# Altium schematic sheet Pg4-Power supply 1.SchDoc: Isolated Poser Supply 1
size 431 x 279 mm; Date: Not shown in title block; ApprovedBy: Not shown in title block; CheckedBy: Not shown in title block; Author: Not shown in title block; CompanyName: Not shown in title block; Engineer: Not shown in title block; Organization: Not shown in title block; Address1: Not shown in title block; Address2: Not shown in title block; Address3: Not shown in title block; Address4: Not shown in title block; DocumentNumber: 5; Revision: Use project parameter SCH_Rev; SheetNumber: 4; SheetTotal: 7; PageSetup: Record=PageOptions|CenterHorizontal=True|CenterVertical=True|PrintScale=0.62|XCorrection=1.00|YCorrection=1.00|PrintKind=0|BorderSize=5000000|LeftOffset=0|BottomOffset=0|Orientation=2|PaperLength=1000|PaperWidth=1000|Scale=100|PaperSource=15|PrintQuality=600|MediaType=1|DitherType=10|PaperKind=Letter|PrintScaleMode=1; CurrentTime: Not shown in title block; CurrentDate: Not shown in title block; Time: Not shown in title block; DocumentFullPathAndName: Not shown in title block; DocumentName: Not shown in title block; ModifiedDate: Not shown in title block; ImagePath: Not shown in title block
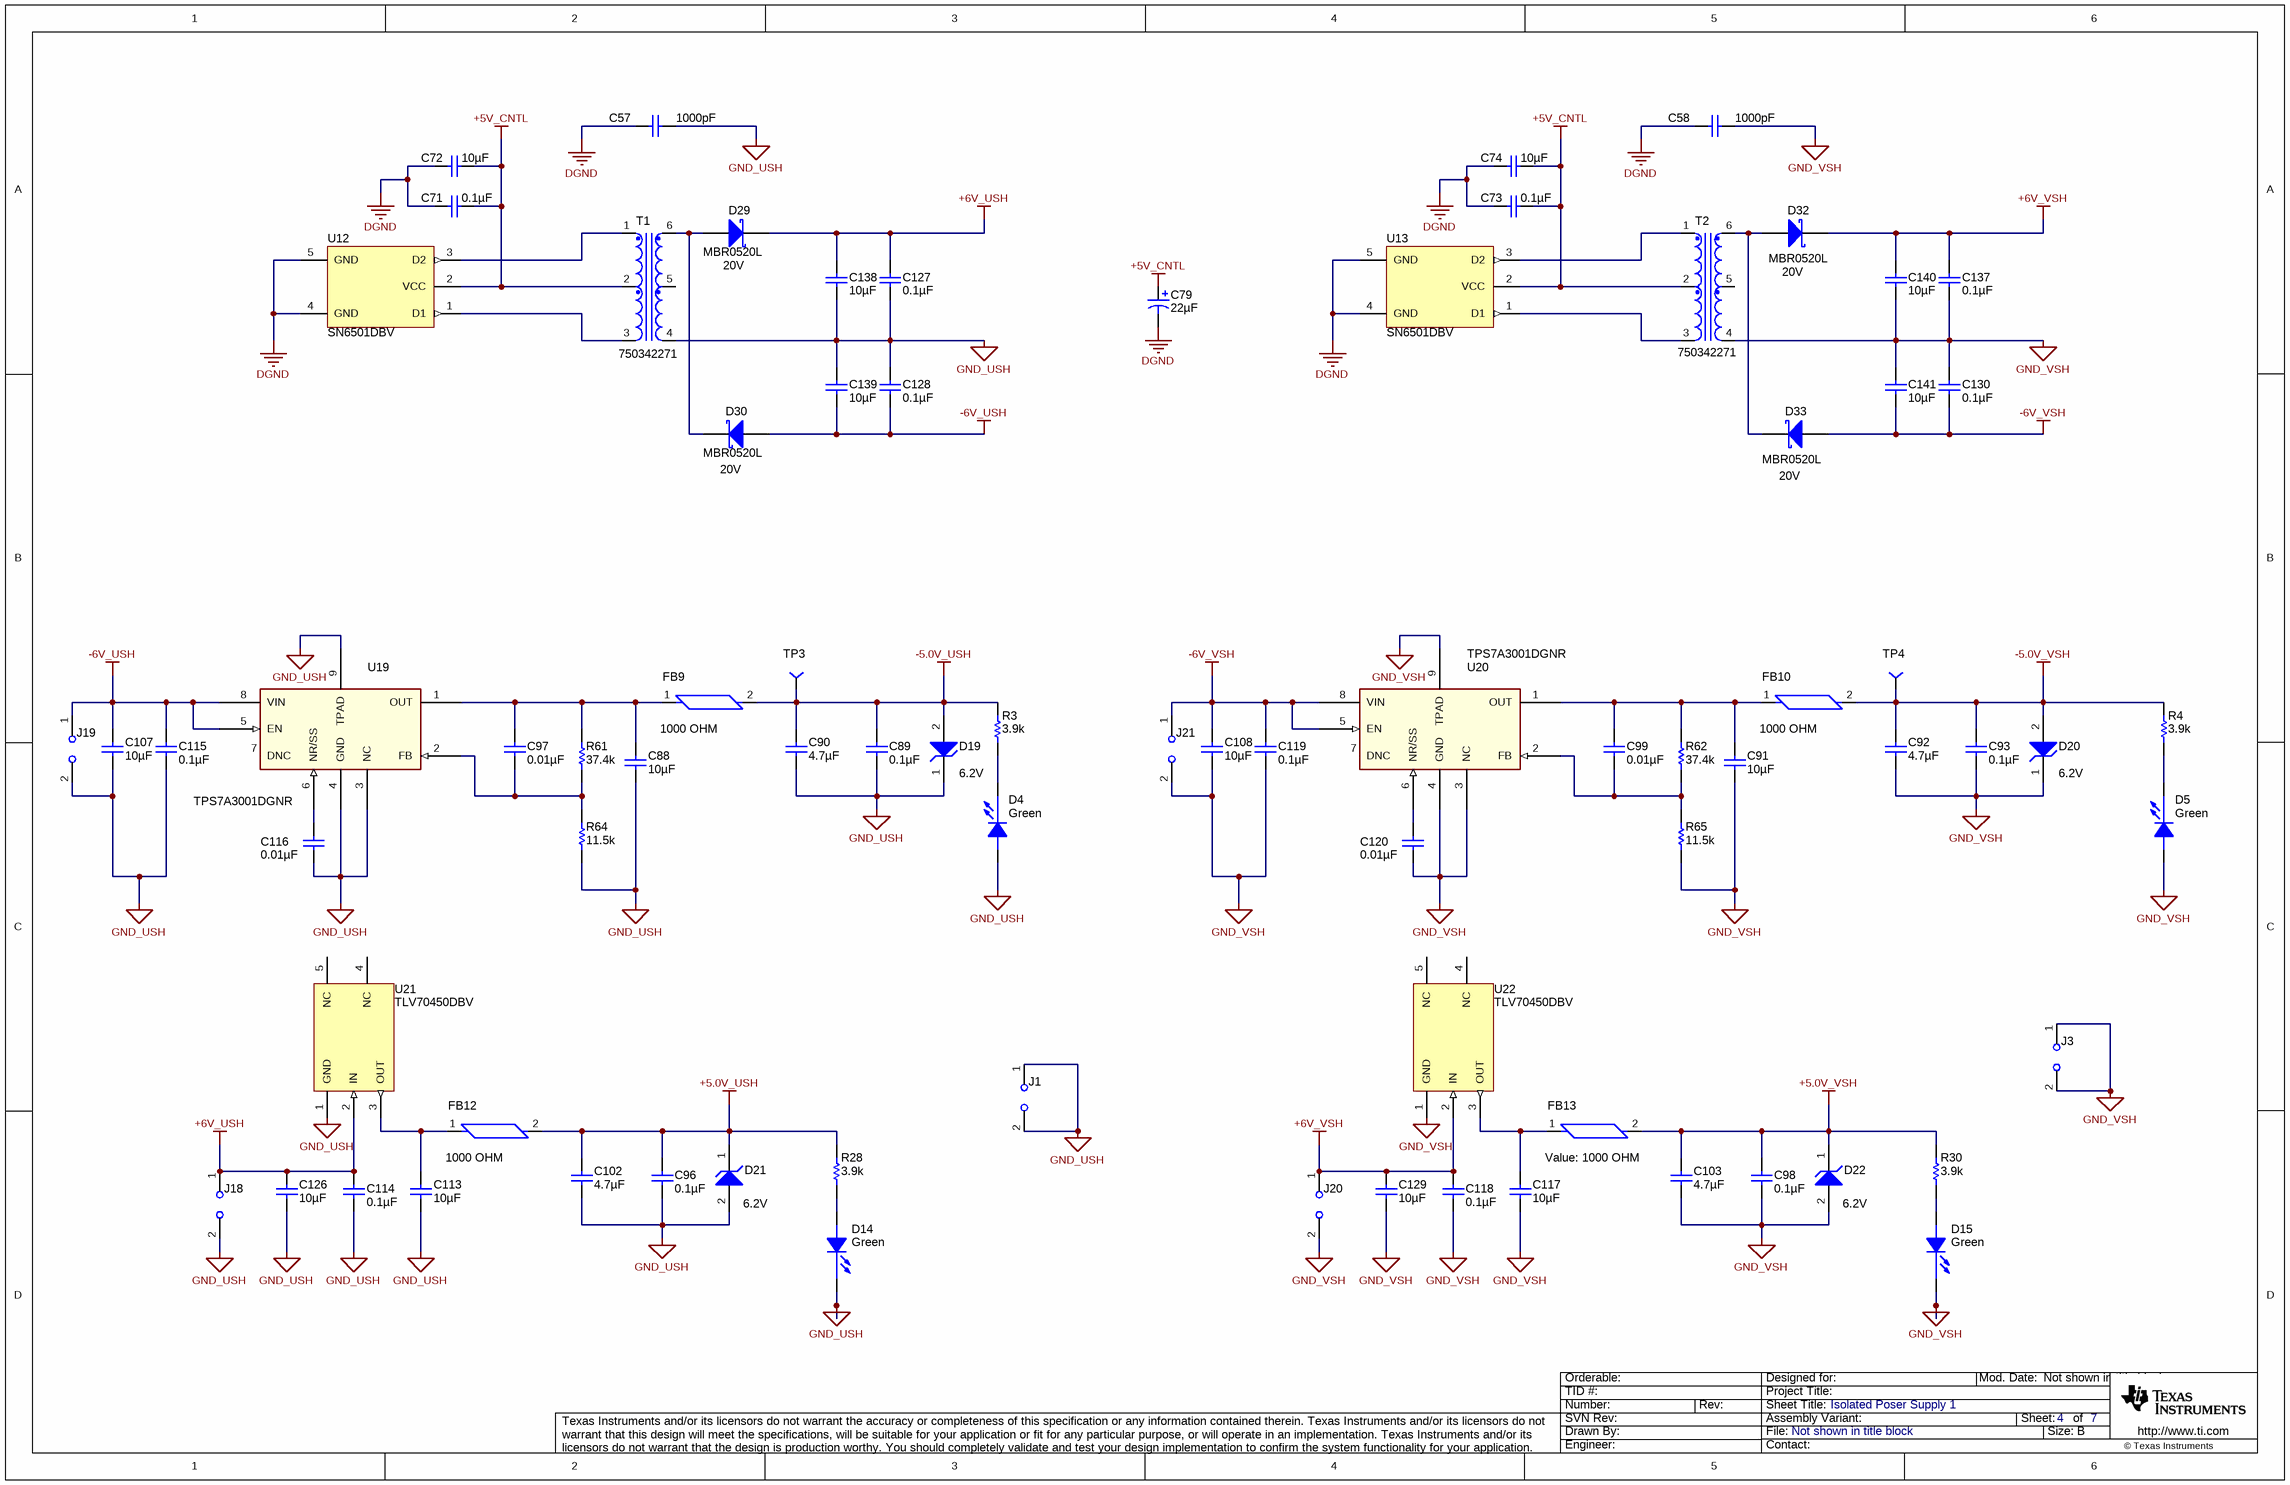
[diagram p0: Pg4-Power supply 1.SchDoc]

## Parts
C57  value 1000pF  [CAP_200mil]
C58  value 1000pF  [CAP_200mil]
C71  ValueDisplayed: 0.1µF  [0603]
C72  ValueDisplayed: 10µF  [1210]
C73  ValueDisplayed: 0.1µF  [0603]
C74  ValueDisplayed: 10µF  [1210]
C79  ValueDisplayed: 22µF  [SM_RADIAL_5MM]  (hidden comment: UUD1E220MCL1GS)
C88  ValueDisplayed: 10µF  [1210]
C89  ValueDisplayed: 0.1µF  [0603]
C90  ValueDisplayed: 4.7µF  [0805_HV]
C91  ValueDisplayed: 10µF  [1210]
C92  ValueDisplayed: 4.7µF  [0805_HV]
C93  ValueDisplayed: 0.1µF  [0603]
C96  ValueDisplayed: 0.1µF  [0603]
C97  ValueDisplayed: 0.01µF  [0603]
C98  ValueDisplayed: 0.1µF  [0603]
C99  ValueDisplayed: 0.01µF  [0603]
C102  ValueDisplayed: 4.7µF  [0805_HV]
C103  ValueDisplayed: 4.7µF  [0805_HV]
C107  ValueDisplayed: 10µF  [1210]
C108  ValueDisplayed: 10µF  [1210]
C113  ValueDisplayed: 10µF  [1210]
C114  ValueDisplayed: 0.1µF  [0603]
C115  ValueDisplayed: 0.1µF  [0603]
C116  ValueDisplayed: 0.01µF  [0603]
C117  ValueDisplayed: 10µF  [1210]
C118  ValueDisplayed: 0.1µF  [0603]
C119  ValueDisplayed: 0.1µF  [0603]
C120  ValueDisplayed: 0.01µF  [0603]
C126  ValueDisplayed: 10µF  [1210]
C127  ValueDisplayed: 0.1µF  [0603]
C128  ValueDisplayed: 0.1µF  [0603]
C129  ValueDisplayed: 10µF  [1210]
C130  ValueDisplayed: 0.1µF  [0603]
C137  ValueDisplayed: 0.1µF  [0603]
C138  ValueDisplayed: 10µF  [1210]
C139  ValueDisplayed: 10µF  [1210]
C140  ValueDisplayed: 10µF  [1210]
C141  ValueDisplayed: 10µF  [1210]
D4  value Green  [LED0603AA]
D5  value Green  [LED0603AA]
D14  value Green  [LED0603AA]
D15  value Green  [LED0603AA]
D19  value 6.2V  [powerDI123]
D20  value 6.2V  [powerDI123]
D21  value 6.2V  [powerDI123]
D22  value 6.2V  [powerDI123]
D29  MBR0520L  value 20V  [SOD-123]
D30  MBR0520L  value 20V  [SOD-123]
D32  MBR0520L  value 20V  [SOD-123]
D33  MBR0520L  value 20V  [SOD-123]
FB9  value 1000 OHM  [FB0603]
FB10  value 1000 OHM  [FB0603]
FB12  value 1000 OHM  [FB0603]
FB13  value 1000 OHM  [FB0603]
J1  (no value)  [HDR100_1X2]
J3  (no value)  [HDR100_1X2]
J18  (no value)  [HDR100_1X2]
J19  (no value)  [HDR100_1X2]
J20  (no value)  [HDR100_1X2]
J21  (no value)  [HDR100_1X2]
R3  value 3.9k  [0603]
R4  value 3.9k  [0603]
R28  value 3.9k  [0603]
R30  value 3.9k  [0603]
R61  value 37.4k  [0603]
R62  value 37.4k  [0603]
R64  value 11.5k  [0603]
R65  value 11.5k  [0603]
T1  750342271  [760390015]
T2  750342271  [760390015]
TP3  (no value)  [TP-040_RND]
TP4  (no value)  [TP-040_RND]
U12  SN6501DBV  [DBV0005A_N]
U13  SN6501DBV  [DBV0005A_N]
U19  TPS7A3001DGNR  [MSOP8(DGN)]
U20  (no value)  [MSOP8(DGN)]
U21  TLV70450DBV  [DBV0005A_N]
U22  TLV70450DBV  [DBV0005A_N]

## Nets
+5.0V_USH: C96.1 C102.2 D21.1(K) FB12.2 R28.2
+5.0V_VSH: C98.1 C103.2 D22.1(K) FB13.2 R30.2
+5V_CNTL: C71.2 C72.2 C73.2 C74.2 C79.1(+) T1.2 T2.2 U12.2(VCC) U13.2(VCC)
+6V_USH: C114.1 C126.2 C127.1 C138.1 D29.1(K) J18.1 U21.2(IN)
+6V_VSH: C118.1 C129.2 C137.1 C140.1 D32.1(K) J20.1 U22.2(IN)
-5.0V_USH: C89.1 C90.2 D19.2(A) FB9.2 R3.2 TP3.1
-5.0V_VSH: C92.2 C93.1 D20.2(A) FB10.2 R4.2 TP4.1
-6V_USH: C107.2 C115.1 C128.2 C139.2 D30.2(A) J19.1 U19.5(EN) U19.8(VIN)
-6V_VSH: C108.2 C119.1 C130.2 C141.2 D33.2(A) J21.1 U20.5(EN) U20.8(VIN)
DGND: C57.1 C58.1 C71.1 C72.1 C73.1 C74.1 C79.2(-) U12.4(GND) U12.5(GND) U13.4(GND) U13.5(GND)
GND_USH: C57.2 C88.1 C89.2 C90.1 C96.2 C102.1 C107.1 C113.1 C114.2 C115.2 C116.1 C126.1 C127.2 C128.1 C138.2 C139.1 D4.2(A) D14.1(C) D19.1(K) D21.2(A) J1.1 J1.2 J18.2 J19.2 R64.1 T1.4 U19.3(NC) U19.4(GND) U19.9(TPAD) U21.1(GND)
GND_VSH: C58.2 C91.1 C92.1 C93.2 C98.2 C103.1 C108.1 C117.1 C118.2 C119.2 C120.1 C129.1 C130.1 C137.2 C140.2 C141.1 D5.2(A) D15.1(C) D20.1(K) D22.2(A) J3.1 J3.2 J20.2 J21.2 R65.1 T2.4 U20.3(NC) U20.4(GND) U20.9(TPAD) U22.1(GND)
NetC88_2: C88.2 C97.2 FB9.1 R61.2 U19.1(OUT)
NetC91_2: C91.2 C99.2 FB10.1 R62.2 U20.1(OUT)
NetC97_1: C97.1 R61.1 R64.2 U19.2(FB)
NetC99_1: C99.1 R62.1 R65.2 U20.2(FB)
NetC113_2: C113.2 FB12.1 U21.3(OUT)
NetC116_2: C116.2 U19.6(NR/SS)
NetC117_2: C117.2 FB13.1 U22.3(OUT)
NetC120_2: C120.2 U20.6(NR/SS)
NetD4_1: D4.1(C) R3.1
NetD5_1: D5.1(C) R4.1
NetD14_2: D14.2(A) R28.1
NetD15_2: D15.2(A) R30.1
NetD29_2: D29.2(A) D30.1(K) T1.6
NetD32_2: D32.2(A) D33.1(K) T2.6
NetT1_1: T1.1 U12.3(D2)
NetT1_3: T1.3 U12.1(D1)
NetT2_1: T2.1 U13.3(D2)
NetT2_3: T2.3 U13.1(D1)

Not connected (* = marked no-connect by the designer): T1 5; T2 5; U19 7(DNC); U20 7(DNC); U21 4(NC) 5(NC); U22 4(NC) 5(NC)

## Notes on the sheet
- Drawn By:
- SVN Rev:
- Number:
- TID #:
- Orderable:
- Rev:
- Sheet Title:
- File:
- Project Title:
- Designed for:
- Assembly Variant:
- Mod. Date:
- Sheet:
- Size:
- of
- B
- http://www.ti.com
- Texas Instruments and/or its licensors do not warrant the accuracy or completeness of this specification or any information contained therein. Texas Instruments and/or its licensors do not warrant that this design will meet the specifications, will be suitable for your application or fit for any particular purpose, or will operate in an implementation. Texas Instruments and/or its licensors do not warrant that the design is production worthy. You should completely validate and test your design implementation to confirm the system functionality for your application.
- Engineer:
- Contact:
- © Texas Instruments

## Library data of the parts
C57 C58 = 202R18W102KV4E: CAP CER 1000PF 1KV 10% RADIAL; PartNumber: S102K29Y5PN63J5R; Manufacturer: Vishay BC Components; Polarized: N; CompType: Capacitor; Tolerance_%: 0; ValueDisplayed: 1000pF; RoHS: Y; Value2: 1kv; MountType: radial; Technology: Ceramic; Publisher: Texas Instruments; ComponentLink1Description: Datasheet link; ComponentLink1URL: http://www.johansondielectrics.com/images/stories/catalog/JDI-Product-Catalog.pdf; Supplier 1: Digi-Key; Supplier Part Number 1: 1251PH-ND
C71 C73 C89 C93 C96 C98 C114 C115 C118 C119 C127 C128 C130 C137 = C0603C104K5RACTU: CAP, CERM, 0.1uF, 50V, +/-10%, X7R, 0603; Manufacturer: Kemet; Polarized: N; CompType: Capacitor; U/M: EA; Cap_F: 0.0000001; Tolerance_%: 10; Value1: Unknown; VDC_V: 50; TaMin_C: -55; TaMax_C: 125; SymbolVersion: 2008-07-09; Value: 0.1uF; PartNumber: C0603C104K5RACTU; PackageReference: 0603; RoHS: Y; Value2: 50V; MountType: SMT; Technology: Ceramic; TempCo: X7R; Cap_Case: 0603; Published: 2008-06-19; Publisher: Texas Instruments; LatestRevisionDate: 2013-12-06; ComponentLink1Description: Datasheet link; ComponentLink1URL: http://www.kemet.com/kemet/web/homepage/kechome.nsf/vapubfiles/F3102_Y5V.pdf/$file/F3102_Y5V.pdf; Supplier 1: Digi-Key; Supplier Part Number 1: 399-5089-1-ND; Supplier 2: Mouser; Supplier Part Number 2: 80-C0603C104K5R; Supplier 3: Farnell; Supplier Part Number 3: 1288255
C72 C74 C88 C91 C107 C108 C113 C117 C126 C129 C138-C141 = GMK325AB7106MM-T: CAP, CERM, 10uF, 35V, +/-20%, X7R, 1210; Manufacturer: Taiyo Yuden; Polarized: N; CompType: Capacitor; U/M: EA; Cap_F: 0.00001; Tolerance_%: 20; Value1: Unknown; VDC_V: 35; TaMin_C: -55; TaMax_C: 125; PackageReference: 1210; PartNumber: GMK325AB7106MM-T; SymbolVersion: 2008-07-09; Value: 10uF; RoHS: Y; Value2: 35V; MountType: SMT; Technology: Ceramic; Cap_Case: 1210; Publisher: Texas Instruments; LatestRevisionDate: 2013-12-06; ComponentLink1Description: Datasheet link; ComponentLink1URL: http://www.yuden.co.jp/productdata/catalog/en/mlcc01_e.pdf; Supplier 1: Digi-Key; Supplier Part Number 1: 587-2779-1-ND; Supplier 2: Mouser; Supplier Part Number 2: 963-GMK325AB7106MM-T; Supplier 3: Farnell; Supplier Part Number 3: 1894510; TempCo: X7R; Published: 2008-06-19
C79 = UUD1E220MCL1GS: CAP, AL, 22uF, 25V, +/-20%, 0.76 ohm, SMD; Manufacturer: Nichicon; Polarized: Y; CompType: Capacitor; U/M: EA; Cap_F: 0.000022; Tolerance_%: 20; VDC_V: 25; ESR_Ohm: 0.76; IRMS_A: 0.15; TaMin_C: -55; TaMax_C: 105; Cap_Case: 5x5.8; SymbolVersion: 2008-07-09; Value: 22uF; PartNumber: UUD1E220MCL1GS; PackageReference: 5x5.8; RoHS: Y; Value1: 0.76 ohm; Value2: 25V; MountType: SMT; Technology: AL; Series: uD; Publisher: Texas Instruments; LatestRevisionDate: 2014-01-08; ComponentLink1Description: Datasheet link; ComponentLink1URL: http://products.nichicon.co.jp/en/pdf/XJA043/e-ud.pdf; Supplier 1: Digi-Key; Supplier Part Number 1: 493-2270-1-ND; Supplier 2: Mouser; Supplier Part Number 2: 647-UUD1E220MCL; Supplier 3: Farnell; Supplier Part Number 3: 1899607
C90 C92 C102 C103 = C2012X5R1H475K125AB: CAP, CERM, 4.7uF, 50V, +/-10%, X5R, 0805; Manufacturer: TDK; Polarized: N; CompType: Capacitor; U/M: EA; Cap_F: 0.0000047; Tolerance_%: 10; Value1: Unknown; VDC_V: 50; TaMin_C: -55; TaMax_C: 85; Cap_Case: 0805; PackageReference: 0805; PartNumber: C2012X5R1H475K125AB; SymbolVersion: 2008-07-09; Value: 4.7uF; RoHS: Y; Value2: 50V; MountType: SMT; Technology: Ceramic; Publisher: Texas Instruments; LatestRevisionDate: 2013-12-06; ComponentLink1Description: Datasheet link; ComponentLink1URL: http://product.tdk.com/capacitor/mlcc/en/productguide/pdf/mlcc_selection_guide_en_03.pdf; Supplier 1: Digi-Key; Supplier Part Number 1: 445-5980-1-ND; TempCo: X5R; Published: 2008-06-19
C97 C99 C116 C120 = 06031C103JAT2A: CAP, CERM, 0.01uF, 100V, +/-5%, X7R, 0603; PartNumber: 06031C103J4Z4A; Manufacturer: AVX; Polarized: N; CompType: Capacitor; U/M: EA; Cap_F: 0.00000001; Tolerance_%: 5; ESR_Ohm: 0.098; Value1: 0.098 ohm; VDC_V: 100; TaMin_C: -55; TaMax_C: 125; SymbolVersion: 2008-07-09; Value: 0.01uF; PackageReference: 0603; RoHS: Y; Value2: 100V; MountType: SMT; Technology: Ceramic; TempCo: X7R; Cap_Case: 0603; Published: 2008-06-19; Publisher: Texas Instruments; LatestRevisionDate: 2013-11-21; ComponentLink1Description: Datasheet link; ComponentLink1URL: http://www.avx.com/docs/masterpubs/smccp.pdf; Supplier 1: Digi-Key; Supplier Part Number 1: 478-7418-1-ND; Supplier 2: Mouser; Supplier Part Number 2: 581-06031C103J; Supplier 3: Farnell; Supplier Part Number 3: 1833876
D4 D5 D14 D15 = LED_LG L29K-G2J1-24-Z: LED SmartLED Green 570NM; Manufacturer: OSRAM; SymbolCreator: x0120606; CompType: *; PartNumber: LG L29K-G2J1-24-Z; Alternate Manufacturer: LED; PackageReference: 0603; ComponentLink1URL: http://catalog.osram-os.com/catalogue/catalogue.do;jsessionid=32CB61882C089EDD4B6D0A54E7E1F117?act=downloadFile&favOid=020000020000138e000100b6; Alternate PartNumber: *; ComponentLink1Description: Datasheet link; Supplier Part Number 1: 475-2709-2-ND; Supplier 1: Digi-Key; MountType: SMT; Publisher: TI
D19-D22 = DFLZ6V2-7: Diode, Zener, 6.2V, 1W, PowerDI123; Manufacturer: Diodes Inc.; U/M: EA; Power_W: 1; Vz_V: 6.2; RJA_CperW: 110; CompType: Zener; SymbolVersion: 2010-08-25; PartNumber: DFLZ6V2-7; PackageReference: PowerDI123; Vr_V: N/A; Value1: 1W; MountType: SMT; RoHS: Y; ComponentLink1Description: Datasheet link; ComponentLink1URL: http://www.diodes.com/datasheets/ds30464.pdf; Published: 2008-10-08; Publisher: Texas Instruments; LatestRevisionDate: 2013-11-26; LatestRevisionNote: Updated Supplier Data; Supplier 1: Digi-Key; Supplier Part Number 1: DFLZ6V2DICT-ND; Supplier 2: Mouser; Supplier Part Number 2: 621-DFLZ6V2-7; Supplier 3: Farnell; Supplier Part Number 3: 2077983
D29 D30 D32 D33 = MBR0520LT1G: Diode, Schottky, 20V, 0.5A, SOD-123; Manufacturer: Fairchild Semiconductor; U/M: EA; Vf_V: 0.385; Value2: 0.385V; Io_A: 0.5; Vr_V: 20; TJmax_C: 125; RJC_CperW: 150; CompType: Diode; SymbolVersion: 2008-12-08; PartNumber: MBR0520L; PackageReference: SOD-123; Value1: 0.5A; MountType: SMT; Type: Schottky; RoHS: Y; Published: 2008-06-26; Publisher: Texas Instruments; LatestRevisionDate: 2013-12-18; ComponentLink1Description: Datasheet link; ComponentLink1URL: http://www.onsemi.com/pub_link/Collateral/MBR0520LT1-D.PDF; Supplier 1: Digi-Key; Supplier Part Number 1: MBR0520LCT-ND; Supplier 2: Mouser; Supplier Part Number 2: 863-MBR0520LT1G; Supplier 3: Farnell; Supplier Part Number 3: 9556915
FB9 FB10 FB12 FB13 = MMZ1608B102C: FERRITE CHIP 1000 OHM 300MA 0603; Manufacturer: TDK Corporation; CompType: Ferrite Bead; PartNumber: MMZ1608B102C; MountType: SMT; Alternate PartNumber: *; Supplier 1: Digi-Key; ComponentLink1URL: http://www.tdk.co.jp/tefe02/e9412_mmz.pdf; ComponentLink1Description: Datasheet link; Publisher: TI; Supplier Part Number 1: 445-8672-1-ND; PackageReference: 0603; Alternate Manufacturer: *; RoHS: Y
J1 J3 J18-J21 = JUMPER_2X100MIL: Header, Male 2-pin, 100mil spacing,; Manufacturer: FCI; PartNumber: 68001-402HLF; area: 20000; Value: 68001-402HLF; ComponentLink1URL: \\vette02\pmp_pcb\pcad_pdf's\pec36saan.pdf; ComponentHeight: 0.330 inch; SymbolVersion: 09/30/2009 09:55:05; PackageReference: 0.100 inch x 2; ComponentLink1Description: AEO Datasheet Link; Supplier 1: Digi-Key; Supplier Part Number 1: 609-3507-ND
R3 R4 R28 R30 = CRCW06033K90JNEA: RES, 3.9k ohm, 5%, 0.1W, 0603; Manufacturer: Vishay-Dale; CompType: Resistor; Res_ohm: 3900; Value_Code: 3k90; Tolerance_%: 5; Power_W: 0.1; VDC_V: 75; TempCo: 200 ppm/C; EIA_Code: E24; U/M: EA; SymbolVersion: 2009-05-29; PartNumber: CRCW06033K90JNEA; PackageReference: 0603; RoHS: Y; Value1: 5%; Value2: 0.1W; MountType: SMT; Technology: Thick Film; Published: 2008-06-26; Publisher: Texas Instruments; LatestRevisionDate: 2013-10-22; ComponentLink1Description: Datasheet link; ComponentLink1URL: http://www.vishay.com/docs/20035/dcrcwe3.pdf; Supplier 1: Digi-Key; Supplier Part Number 1: 541-3.9KGCT-ND; Supplier 2: Farnell; Supplier Part Number 2: 1563917; Supplier 3: Newark; Supplier Part Number 3: 72M6834
R61 R62 = RT0603BRD0737KL: RES 37.4K OHM 1/10W .1% 0603 SMD; PartNumber: ERA-3AEB3742V; Manufacturer: Panasonic; CompType: Resistor; Res_ohm: 37000; Value_Code: 37k4; Tolerance_%: 1%; Power_W: 0.1; Value2: 0.1W; VDC_V: 75; TempCo: 25 ppm/C; EIA_Code: E192; U/M: EA; SymbolVersion: 2009-05-29; PackageReference: 0603; RoHS: Y; MountType: SMT; Technology: Thin Film; Published: 2008-06-26; Publisher: Texas Instruments; LatestRevisionDate: 2013-10-22; ComponentLink1Description: Datasheet link; ComponentLink1URL: http://www.yageo.com/pdf/PYu-RT_1-to-0.05_RoHS_L_3.pdf; Supplier 1: Digi-Key; Supplier Part Number 1: P37.4KDBCT-ND
R64 R65 = CRCW060311K5FKEA: RES, 11.5k ohm, 1%, 0.1W, 0603; Manufacturer: Vishay-Dale; CompType: Resistor; Res_ohm: 11500; Value_Code: 11k5; Tolerance_%: 1; Power_W: 0.1; VDC_V: 75; TempCo: 100 ppm/C; EIA_Code: E96; U/M: EA; SymbolVersion: 2009-05-29; PartNumber: CRCW060311K5FKEA; PackageReference: 0603; RoHS: Y; Value1: 1%; Value2: 0.1W; MountType: SMT; Technology: Thick Film; Published: 2008-06-26; Publisher: Texas Instruments; LatestRevisionDate: 2013-10-22; ComponentLink1Description: Datasheet link; ComponentLink1URL: http://www.vishay.com/docs/20035/dcrcwe3.pdf; Supplier 1: Digi-Key; Supplier Part Number 1: 541-11.5KHCT-ND; Supplier 2: Mouser; Supplier Part Number 2: 71-CRCW0603-11.5K-E3; Supplier 3: Farnell; Supplier Part Number 3: 1469753
T1 T2 = TRNSFMR: Transformer 469uH SMD; Manufacturer: Wurth Electronics Midcom; Alternate Manufacturer: *; RoHS: Y; Value: 469uH; MountType: SMT; PartNumber: 750342271; PackageReference: 10.05mm L x 6.73mm W; Publisher: TI; ComponentLink1Description: Datasheet Link; Alternate PartNumber: *; CompType: Transformer; Supplier 1: Digi-Key
TP3 TP4 = TP-040_RND: Test Point, O.040 Hole; Manufacturer: STD; Value: STD; area: *; SymbolVersion: 06/30/2008 16:03:57; PartNumber: STD; ComponentLink1Description: AEO Datasheet Link
U12 U13 = SN6501DBV: Transformer Driver for Isolated Power Supplies, DBV0005A; Alternate Manufacturer: None; Manufacturer: Texas Instruments; SymbolCreator: a0411947; CompType: IC; U/M: EA; SymbolVersion: 2013-06-28; PartNumber: SN6501DBV; PackageReference: DBV0005A; MountType: SMT; ComponentLink1Description: Datasheet Link; ComponentLink1URL: http://www.ti.com/lit/ds/symlink/sn6501.pdf; RoHS: Y; Publisher: Texas Instruments; LatestRevisionDate: 2013-12-23
U19 U20 = TPS7A3001DGNR: -36V, -200mA, Ultralow-Noise, Negative Linear Regulator; Alternate Manufacturer: None; Manufacturer: Texas Instruments; CompType: IC; SymbolCreator: x0120606; ComponentLink1URL: http://www.ti.com/lit/ds/symlink/tps7a3001.pdf; ComponentLink1Description: Datasheet Link; Publisher: Texas Instruments; PackageReference: MSOP-PowerPAD (DGN) | 8; RoHS: Y; PartNumber: TPS7A3001DGNR; MountType: SMT
U21 U22 = TLV70450DBV: Regulator, LDO, 5V, 0.15A, SOT23-5; Alternate Manufacturer: None; Manufacturer: Texas Instruments; SymbolCreator: x0120606; CompType: IC; PartNumber: TLV70450DBV; PackageReference: DBV0005A; MountType: SMT; ComponentLink1Description: Datasheet Link; ComponentLink1URL: http://www.ti.com/lit/ds/symlink/tlv70450.pdf; RoHS: Y; Publisher: Texas Instruments